# EAGLE design 315_gps_neom8u (EAGLE 9.2.2)
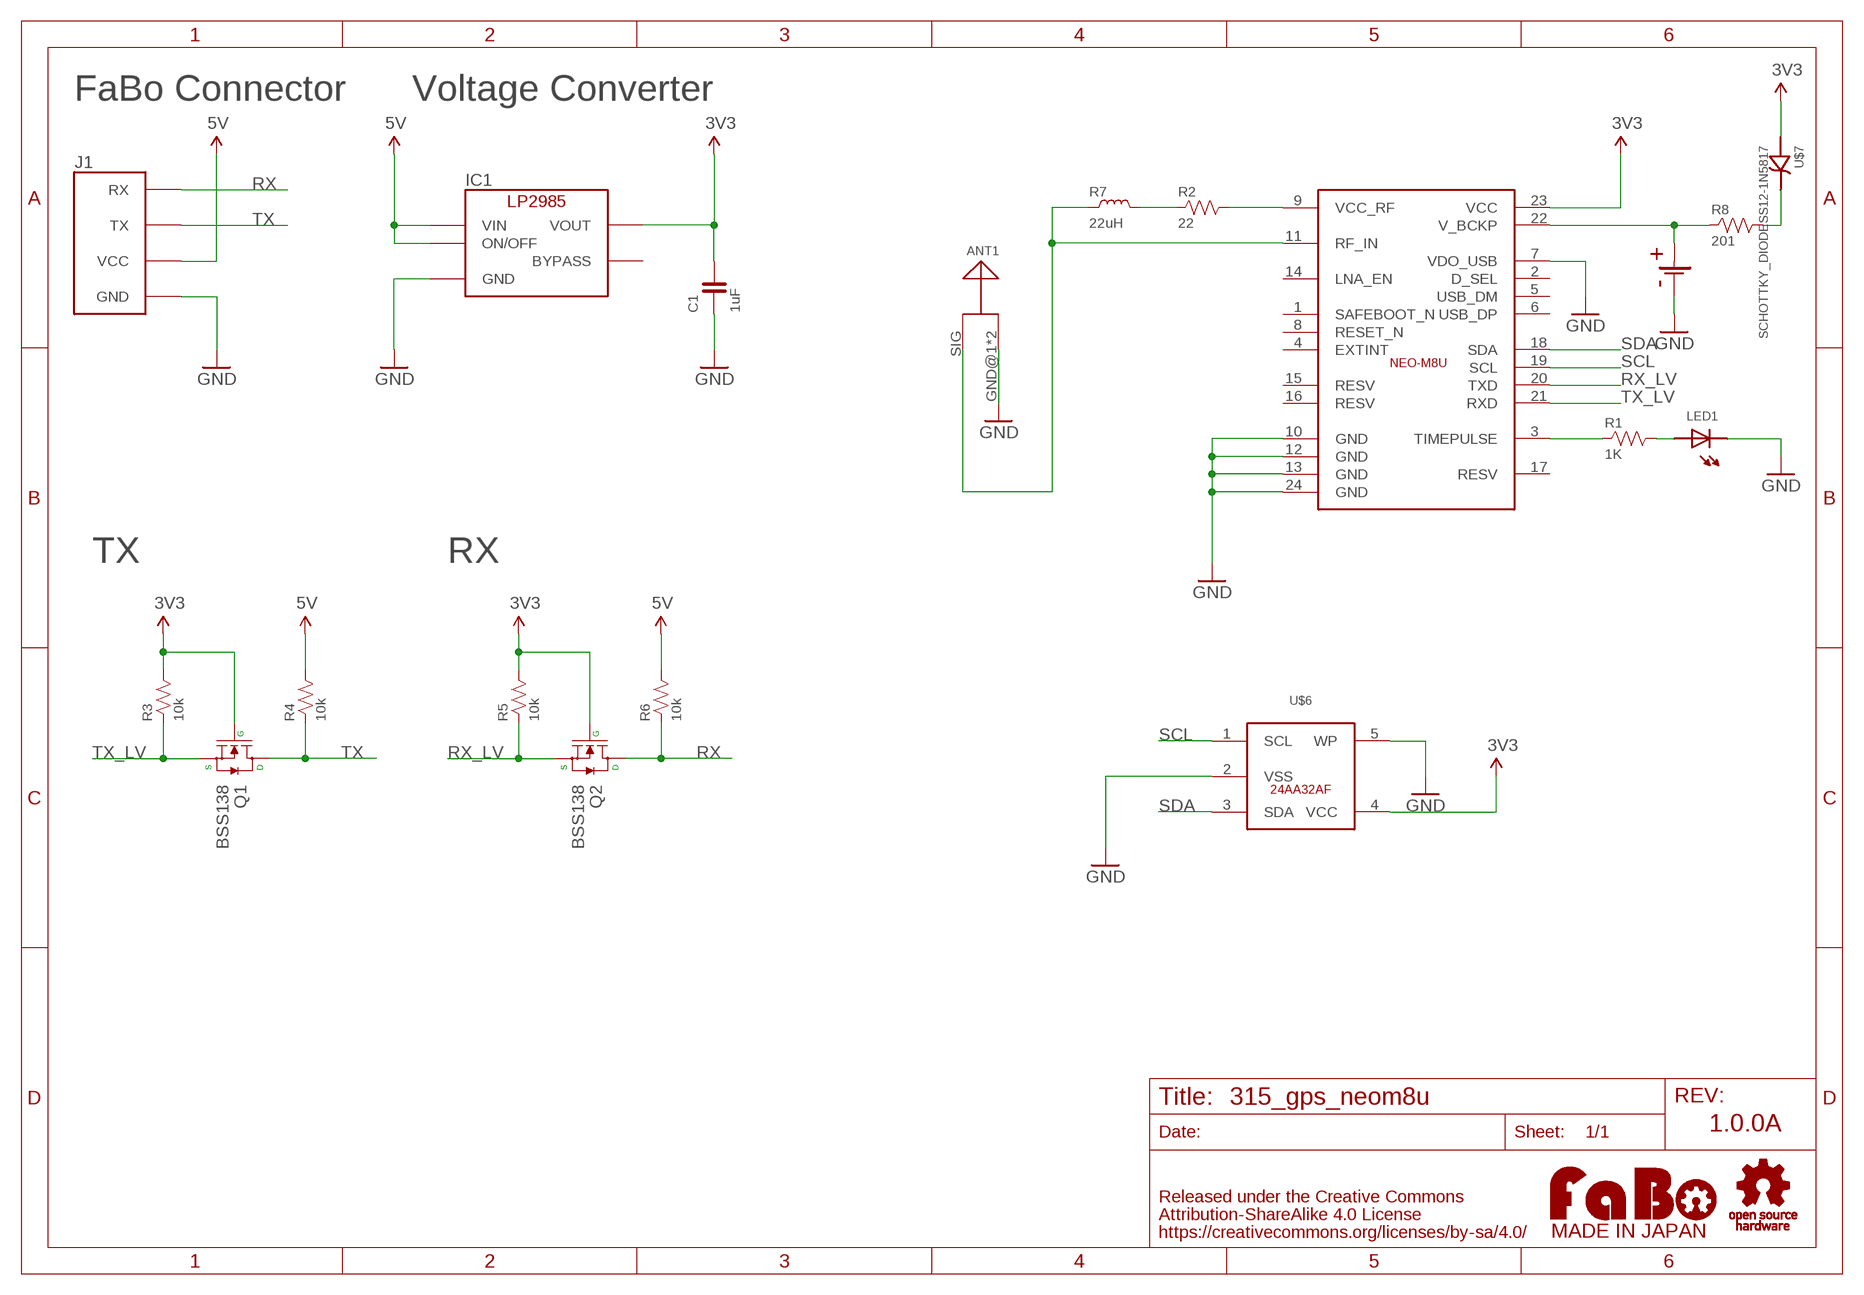
[diagram p0: schematic, sheet 1]

## Parts
ANT1  ANTENA_HIROSE-UF-L  [HIROSE-UF-L]
C1  1uF  CAPACITOR-0603_NARROW  [0603-NARROW]
IC1  LP2985-33DBV  [SOT-23-5]
J1  FABO_BRICK_SERIAL  [FABO_BRICK_SERIAL]
LED1  LED-0603  [0603]
Q1  BSS138  MOSFET-N-BSS138  [SOT23-3]
Q2  BSS138  MOSFET-N-BSS138  [SOT23-3]
R1  1K  RESISTOR-0603-NARROW  [0603-NARROW]
R2  22  RESISTOR-0603-NARROW  [0603-NARROW]
R3  10k  RESISTOR-0603-NARROW  [0603-NARROW]
R4  10k  RESISTOR-0603-NARROW  [0603-NARROW]
R5  10k  RESISTOR-0603-NARROW  [0603-NARROW]
R6  10k  RESISTOR-0603-NARROW  [0603-NARROW]
R7  22uH  COIL-0603  [0603]
R8  201  RESISTOR-0603-NARROW  [0603-NARROW]
U$2  LOGO_OSHW-M_BOTTOM  [LOGO_OSHW_M_BOTTOM]
U$3  LOGO_FABO-M_BOTTOM  [LOGO_FABO_MS_BOTTOM]
U$4  NEO-M8U  [NEO-M8M]
U$6  24AA32AF  [24AA32AF]
U$7  SCHOTTKY_DIODESS12-1N5817  [DO-214AC]
U$10  COILCELLBK-885-BOTTOM  [BK-885]

## Nets
3V3: C1.2 IC1.5(VOUT) Q1.1(G) Q2.1(G) R3.2 R5.2 U$4.23(VCC) U$6.4(VCC) U$7.CATHODE
5V: IC1.1(VIN) IC1.3(ON/OFF) J1.VCC R4.2 R6.2
GND: ANT1.GND@1(GND) ANT1.GND@2(GND) C1.1 IC1.2(GND) J1.GND LED1.CATHODE U$4.7(VDO_USB) U$4.10(GND) U$4.12(GND) U$4.13(GND) U$4.24(GND) U$6.2(VSS) U$6.5(WP) U$10.GND1(-) U$10.GND2(-)
N$1: R1.1 U$4.3(TIMEPULSE)
N$2: LED1.ANODE R1.2
N$3: R8.2 U$7.ANODE
N$4: R8.1 U$4.22(V_BCKP) U$10.VCC(+)
N$5: R2.2 U$4.9(VCC_RF)
N$6: R2.1 R7.2
N$7: ANT1.SIG R7.1 U$4.11(RF_IN)
RX: J1.RX Q2.3(D) R6.1
RX_LV: Q2.2(S) R5.1 U$4.20(TXD)
SCL: U$4.19(SCL) U$6.1(SCL)
SDA: U$4.18(SDA) U$6.3(SDA)
TX: J1.TX Q1.3(D) R4.1
TX_LV: Q1.2(S) R3.1 U$4.21(RXD)
Unconnected: IC1.4(BYPASS) U$4.1(SAFEBOOT_N) U$4.2(D_SEL) U$4.4(EXTINT) U$4.5(USB_DM) U$4.6(USB_DP) U$4.8(RESET_N) U$4.14(LNA_EN) U$4.15(RESV) U$4.16(RESV) U$4.17(RESV)

## Notes on the sheet
- FaBo Connector | Voltage Converter
- TX | RX
- 1.0.0A

## Library data of the parts
ANT1 = FaBo-Antena:ANTENA
C1 = FaBo-Capacitor:CAPACITOR: CAPACITOR
IC1 = FaBo-Supply:LP2985: LP2985
J1 = FaBo-Template:FABO_BRICK_SERIAL: FaBo Brick Serial
LED1 = FaBo-LED:LED
Q1 Q2 = FaBo-etc:MOSFET-N
R1-R6 R8 = FaBo-Resistors:RESISTOR: RESISTOR
R7 = FaBo-Coil:COIL: RESISTOR
U$2 = FaBo-etc:LOGO_OSHW
U$3 = FaBo-etc:LOGO_FABO
U$4 = FaBo-GPS:NEO-M8U
U$6 = FaBo-EEPROM:24AA32AF
U$7 = FaBo-Diode:SCHOTTKY_DIODE
U$10 = FaBo-Supply:COILCELL

## Board
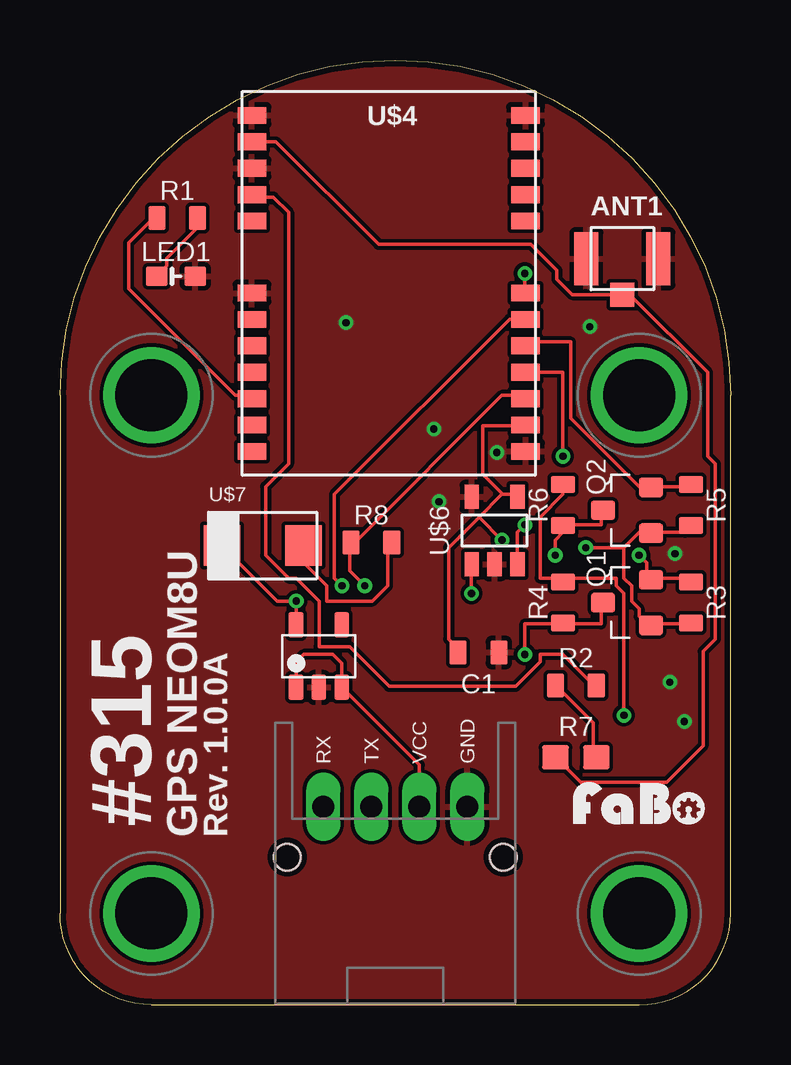
[diagram p1: board, top side]
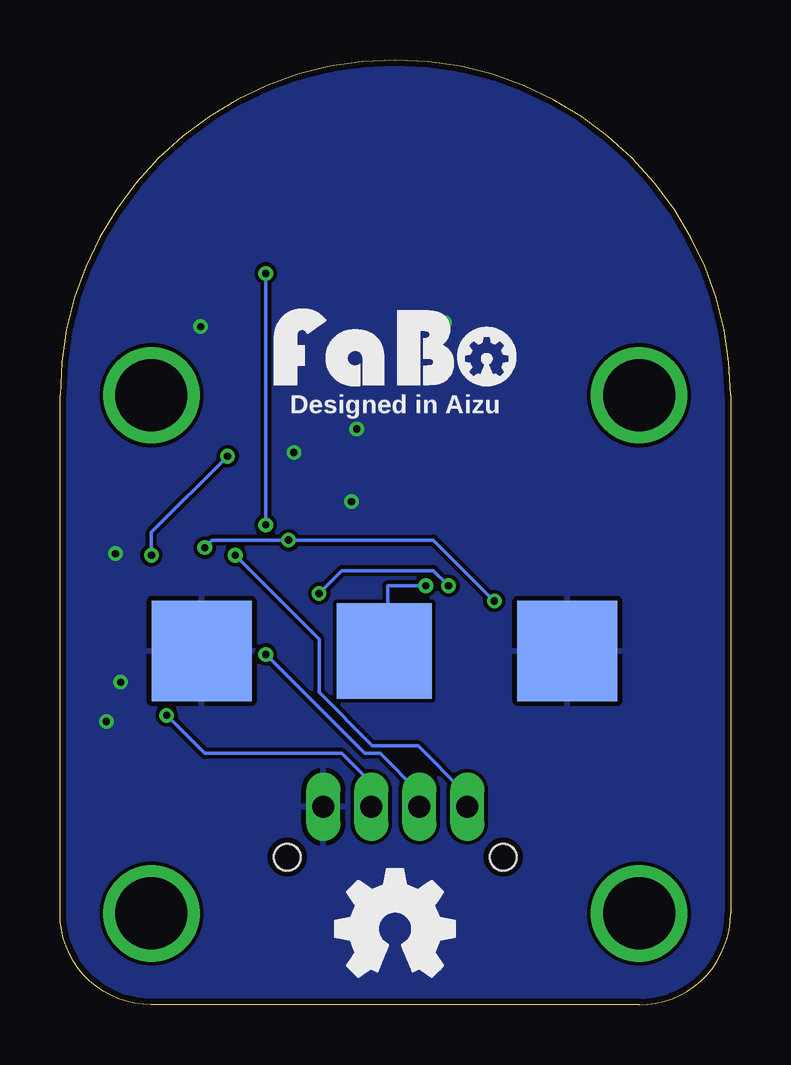
[diagram p2: board, bottom side, seen from below]

Size 27.94 x 39.37 mm. Coordinates in mm from the lower left corner, seen from the top.
Copper layers (1*16): Top 0.035mm / dielectric 1.6mm / Bottom 0.035mm
Design rules "PCBway": minimum track width 6mil, minimum drill 12mil, track to track 6mil, track to pad 6mil, pad to pad 6mil, via to via 6mil, smd to smd 6mil, copper to edge 10mil, drill to drill 10mil, minimum pad ring 10mil, minimum via ring 6mil, stop-mask expansion 2mil, vias tented up to drill 100mil, thermal gap 8mil

### Footprints (pad centres in the part's own frame; a part is rotated, then mirrored left to right if it is on the bottom)
HIROSE-UF-L = smd 1 x 2.2: GND@1 -1.5,0; GND@2 1.5,0 | smd 1 x 1: SIG 0,-1.5
0603-NARROW = smd 0.71 x 1: 1 -0.85,0; 2 0.85,0
SOT-23-5 = smd 0.6 x 1.05: 1 -0.95,-1.3; 2 0,-1.3; 3 0.95,-1.3; 4 0.95,1.3; 5 -0.95,1.3
FABO_BRICK_SERIAL = drill 0.9 pad 1.422 long: GND 3,-10.795; RX -3,-10.795; TX -1,-10.795; VCC 1,-10.795 | drill 3 pad 3.81: P$1 -10.16,6.35; P$2 10.16,6.35; P$3 -10.16,-15.24; P$4 10.16,-15.24 | hole 1.1: -4.5,-12.895; 4.5,-12.895
0603 = smd 0.9 x 0.8: ANODE -0.8,0; CATHODE 0.8,0
SOT23-3 = smd 0.8 x 1: 1 -0.95,-1; 2 0.95,-1; 3 0,1
0603' = smd 1.1 x 1: 1 -0.85,0; 2 0.85,0
NEO-M8M = smd 1.2 x 0.7: 1 -5.7,-7; 2 -5.7,-5.9; 3 -5.7,-4.8; 4 -5.7,-3.7; 5 -5.7,-2.6; 6 -5.7,-1.5; 7 -5.7,-0.4; 8 -5.7,2.6; 9 -5.7,3.7; 10 -5.7,4.8; 11 -5.7,5.9; 12 -5.7,7; 13 5.7,7; 14 5.7,5.9; 15 5.7,4.8; 16 5.7,3.7; 17 5.7,2.6; 18 5.7,-0.4; 19 5.7,-1.5; 20 5.7,-2.6; 21 5.7,-3.7; 22 5.7,-4.8; 23 5.7,-5.9; 24 5.7,-7
24AA32AF = smd 0.6 x 1: 1 -0.95,-1.4; 2 0,-1.4; 3 0.95,-1.4; 4 0.95,1.4; 5 -0.95,1.4
DO-214AC = smd 1.52 x 1.68: ANODE 1.7,0; CATHODE -1.7,0
BK-885 = smd 4.17 x 4.17 bottom: GND1 -7.62,0; GND2 7.62,0 | smd 3.96 x 3.96 bottom: VCC 0,0

### Placement (x,y rotation side)
ANT1  23.43,31.09 0 top
C1  17.43,14.68 180 top
IC1  10.78,14.53 0 top
J1  13.97,19.05 0 top
LED1  4.83,30.36 0 top
LOGO1  [LOGO_FABO_M_BOTTOM]  13.97,25.4 0 top
Q1  23.62,16.76 90 top
Q2  23.62,20.61 90 top
R1  4.88,32.78 0 top
R2  21.5,13.31 0 top
R3  26.29,16.76 270 top
R4  20.95,16.76 90 top
R5  26.29,20.83 270 top
R6  20.95,20.83 90 top
R7  22uH  [0603']  21.5,10.32 0 top
R8  12.97,19.26 0 top
U$2  13.97,3.17 0 top
U$4  13.7,30.06 0 top
U$5  [LOGO_FABO_S]  24.19,7.37 0 top
U$6  18.11,19.76 0 top
U$7  8.44,19.14 0 top
U$10  14.42,14.74 0 top

### Tracks (layer width: path | path; a pad name or v marks a point on that pad's centre or on a via)
3V3  (via drill 0.3)
  Top 0.152: R3.2 26.04,15.88 24.77,15.88 Q1.1 24.45,15.88 24.13,16.19 24.13,16.51 23.81,16.83 23.81,17.46 23.5,17.78 23.5,19.05 | R5.2 26.04,19.68 24.77,19.68 Q2.1 24.45,19.68 24.13,19.68 23.5,19.05 | 17.46,20.32 18.41,21.27 18.44,21.27 | 17.46,20.32 16.19,19.05 16.19,15.24 16.51,14.92 C1.2 | 18.44,21.27 19.05,21.27 U$6.4 | 18.44,21.27 17.61,22.11 17.61,24.13 19.37,24.13 U$4.23 | v21.91,19.05 23.5,19.05 | 17.46,20.32 v18.41,19.37 | IC1.5 v9.84,16.82 v9.84,16.83 9.05,16.83 U$7.CATHODE
  Bottom 0.152: v21.91,19.05 21.59,19.37 v18.41,19.37 12.38,19.37 v9.84,16.83
5V  (via drill 0.3)
  Top 0.152: 20.95,17.78 20,17.78 20,20.32 20.95,21.27 R6.2 | IC1.1 9.84,13.34 9.84,14.29 10.16,14.61 11.37,14.61 11.73,14.24 IC1.3 14.97,10 J1.VCC | 20.95,17.78 23.18,17.78 23.18,17.46 23.5,17.14 v23.5,12.06 | 20.95,17.78 R4.2
  Bottom 0.152: v23.5,12.06 21.91,10.48 16.19,10.48 15.24,9.53 15.24,8.26 J1.VCC
GND  (via drill 0.3)
  other vias: 11.91,28.42 15.58,24 22.08,28.26 25.41,13.45 26.01,11.81 15.79,20.97 18.2,23.01 25.63,18.8
  pour Bottom: 0,0 27.94,0 27.94,39.37 0,39.37
  pour Top: 0,0 27.94,0 27.94,39.37 0,39.37
N$1
  Top 0.152: R1.1 3.81,32.7 2.86,31.75 2.86,29.84 7.3,25.4 7.94,25.4 U$4.3
N$2
  Top 0.152: LED1.ANODE 4.13,30.48 4.45,30.8 4.45,31.11 5.71,32.38 5.71,32.7 R1.2
N$3
  Top 0.152: R8.2 13.65,19.05 13.65,17.46 13.02,16.83 11.11,16.83 11.11,17.46 10.16,18.41 10.16,19.05 U$7.ANODE
N$4  (via drill 0.3)
  Top 0.152: U$4.22 19.37,25.4 18.41,25.4 12.38,19.37 R8.1 12.06,19.05 12.06,18.1 v12.7,17.46
  Bottom 0.152: v12.7,17.46 14.29,17.46 14.29,14.92 U$10.VCC
N$5
  Top 0.152: R2.2 22.23,13.34 20.95,14.61 20,14.61 20,14.29 18.99,13.27 13.72,13.27 12.06,14.92 10.79,14.92 10.79,16.83 9.84,17.78 9.53,17.78 8.57,18.73 8.57,21.59 9.53,22.54 9.53,33.02 8.89,33.66 8.26,33.66 U$4.9
N$6
  Top 0.152: R2.1 20.95,13.02 22.23,11.75 22.23,10.48 R7.2
N$7
  Top 0.152: U$4.11 9,35.96 13.27,31.69 19.62,31.69 20.7,30.61 20.7,30.23 21.34,29.59 21.89,29.59 ANT1.SIG 23.75,29.59 26.99,26.35 26.99,22.86 27.3,22.54 27.3,15.24 26.8,14.73 26.8,10.79 25.27,9.27 21.7,9.27 R7.1
RX  (via drill 0.3)
  Top 0.152: Q2.3 22.54,20.32 22.54,20 20.95,20 R6.1 20.95,19.68 20.64,19.37 v20.64,18.73
  Bottom 0.152: v20.64,18.73 17.14,15.24 17.14,13.02 14.92,10.79 13.02,10.79 11.11,8.89 11.11,8.26 J1.RX
RX_LV
  Top 0.152: R5.1 26.04,21.59 24.77,21.59 Q2.2 24.45,21.27 21.27,24.45 21.27,27.62 19.68,27.62 U$4.20
SCL  (via drill 0.3)
  Top 0.152: v17.14,17.14 17.14,18.1 U$6.1 | v11.75,17.46 11.43,17.78 11.43,21.27 18.73,28.57 19.37,28.57 U$4.19
  Bottom 0.152: v17.14,17.14 16.19,18.1 12.38,18.1 v11.75,17.46
SDA  (via drill 0.3)
  Top 0.152: v19.37,20 19.05,19.68 19.05,18.41 U$6.3 | v19.37,30.48 19.37,29.84 U$4.18
  Bottom 0.152: v19.37,30.48 v19.37,20
TX  (via drill 0.3)
  Top 0.152: 20.95,15.88 22.54,15.88 22.54,16.51 Q1.3 | 20.95,15.88 19.37,15.88 v19.37,14.61 | 20.95,15.88 R4.1
  Bottom 0.152: v19.37,14.61 15.24,10.48 14.61,10.48 13.02,8.89 13.02,8.26 J1.TX
TX_LV  (via drill 0.3)
  Top 0.152: R3.1 26.04,17.78 24.77,17.78 Q1.2 24.45,17.78 24.45,18.41 v24.13,18.73 | v20.95,22.86 20.95,26.35 19.68,26.35 U$4.21
  Bottom 0.152: v20.95,22.86 24.13,19.68 v24.13,18.73

### Text on the board
tPlace: #315 | GPS NEOM8U | Rev. 1.0.0A
bPlace: Designed in Aizu